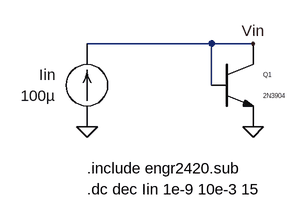
[diagram p0: schematic Experiment 1.asc]
Experiment 1.asc, the LTspice schematic file:
Version 4
SHEET 1 880 680
WIRE 256 112 64 112
WIRE 320 112 256 112
WIRE 256 176 256 112
FLAG 64 240 0
FLAG 320 240 0
FLAG 320 112 Vin
SYMBOL cktsym\\npn 320 176 R0
SYMATTR Value 2N3904
SYMATTR InstName Q1
SYMBOL cktsym\\isource 64 176 R180
WINDOW 3 48 -16 Left 2
WINDOW 0 48 16 Left 2
WINDOW 123 0 0 Left 0
WINDOW 39 0 0 Left 0
SYMATTR Value 100µ
SYMATTR InstName Iin
TEXT 64 304 Left 2 !.include engr2420.sub
TEXT 64 336 Left 2 !.dc dec Iin 1e-9 10e-3 15

The netlist it stands for:
* Experiment 1.asc
Q1 Vin Vin 0 0 2N3904
Iin 0 Vin 100µ
.model NPN NPN
.model PNP PNP
.lib standard.bjt
.include engr2420.sub
.dc dec Iin 1e-9 10e-3 15
.backanno
.end